# Altium schematic sheet Cymometer.SchDoc
size A3; PageSetup: Record=PageOptions|CenterHorizontal=True|CenterVertical=True|PrintScale=0.73|XCorrection=1.00|YCorrection=1.00|PrintKind=0|BorderSize=5000000|LeftOffset=0|BottomOffset=0|Orientation=2|PaperLength=1000|PaperWidth=1000|Scale=100|PaperSource=7|PrintQuality=-3|MediaType=1|DitherType=10|PrintScaleMode=1|PaperKind=A4|PaperIndex=9
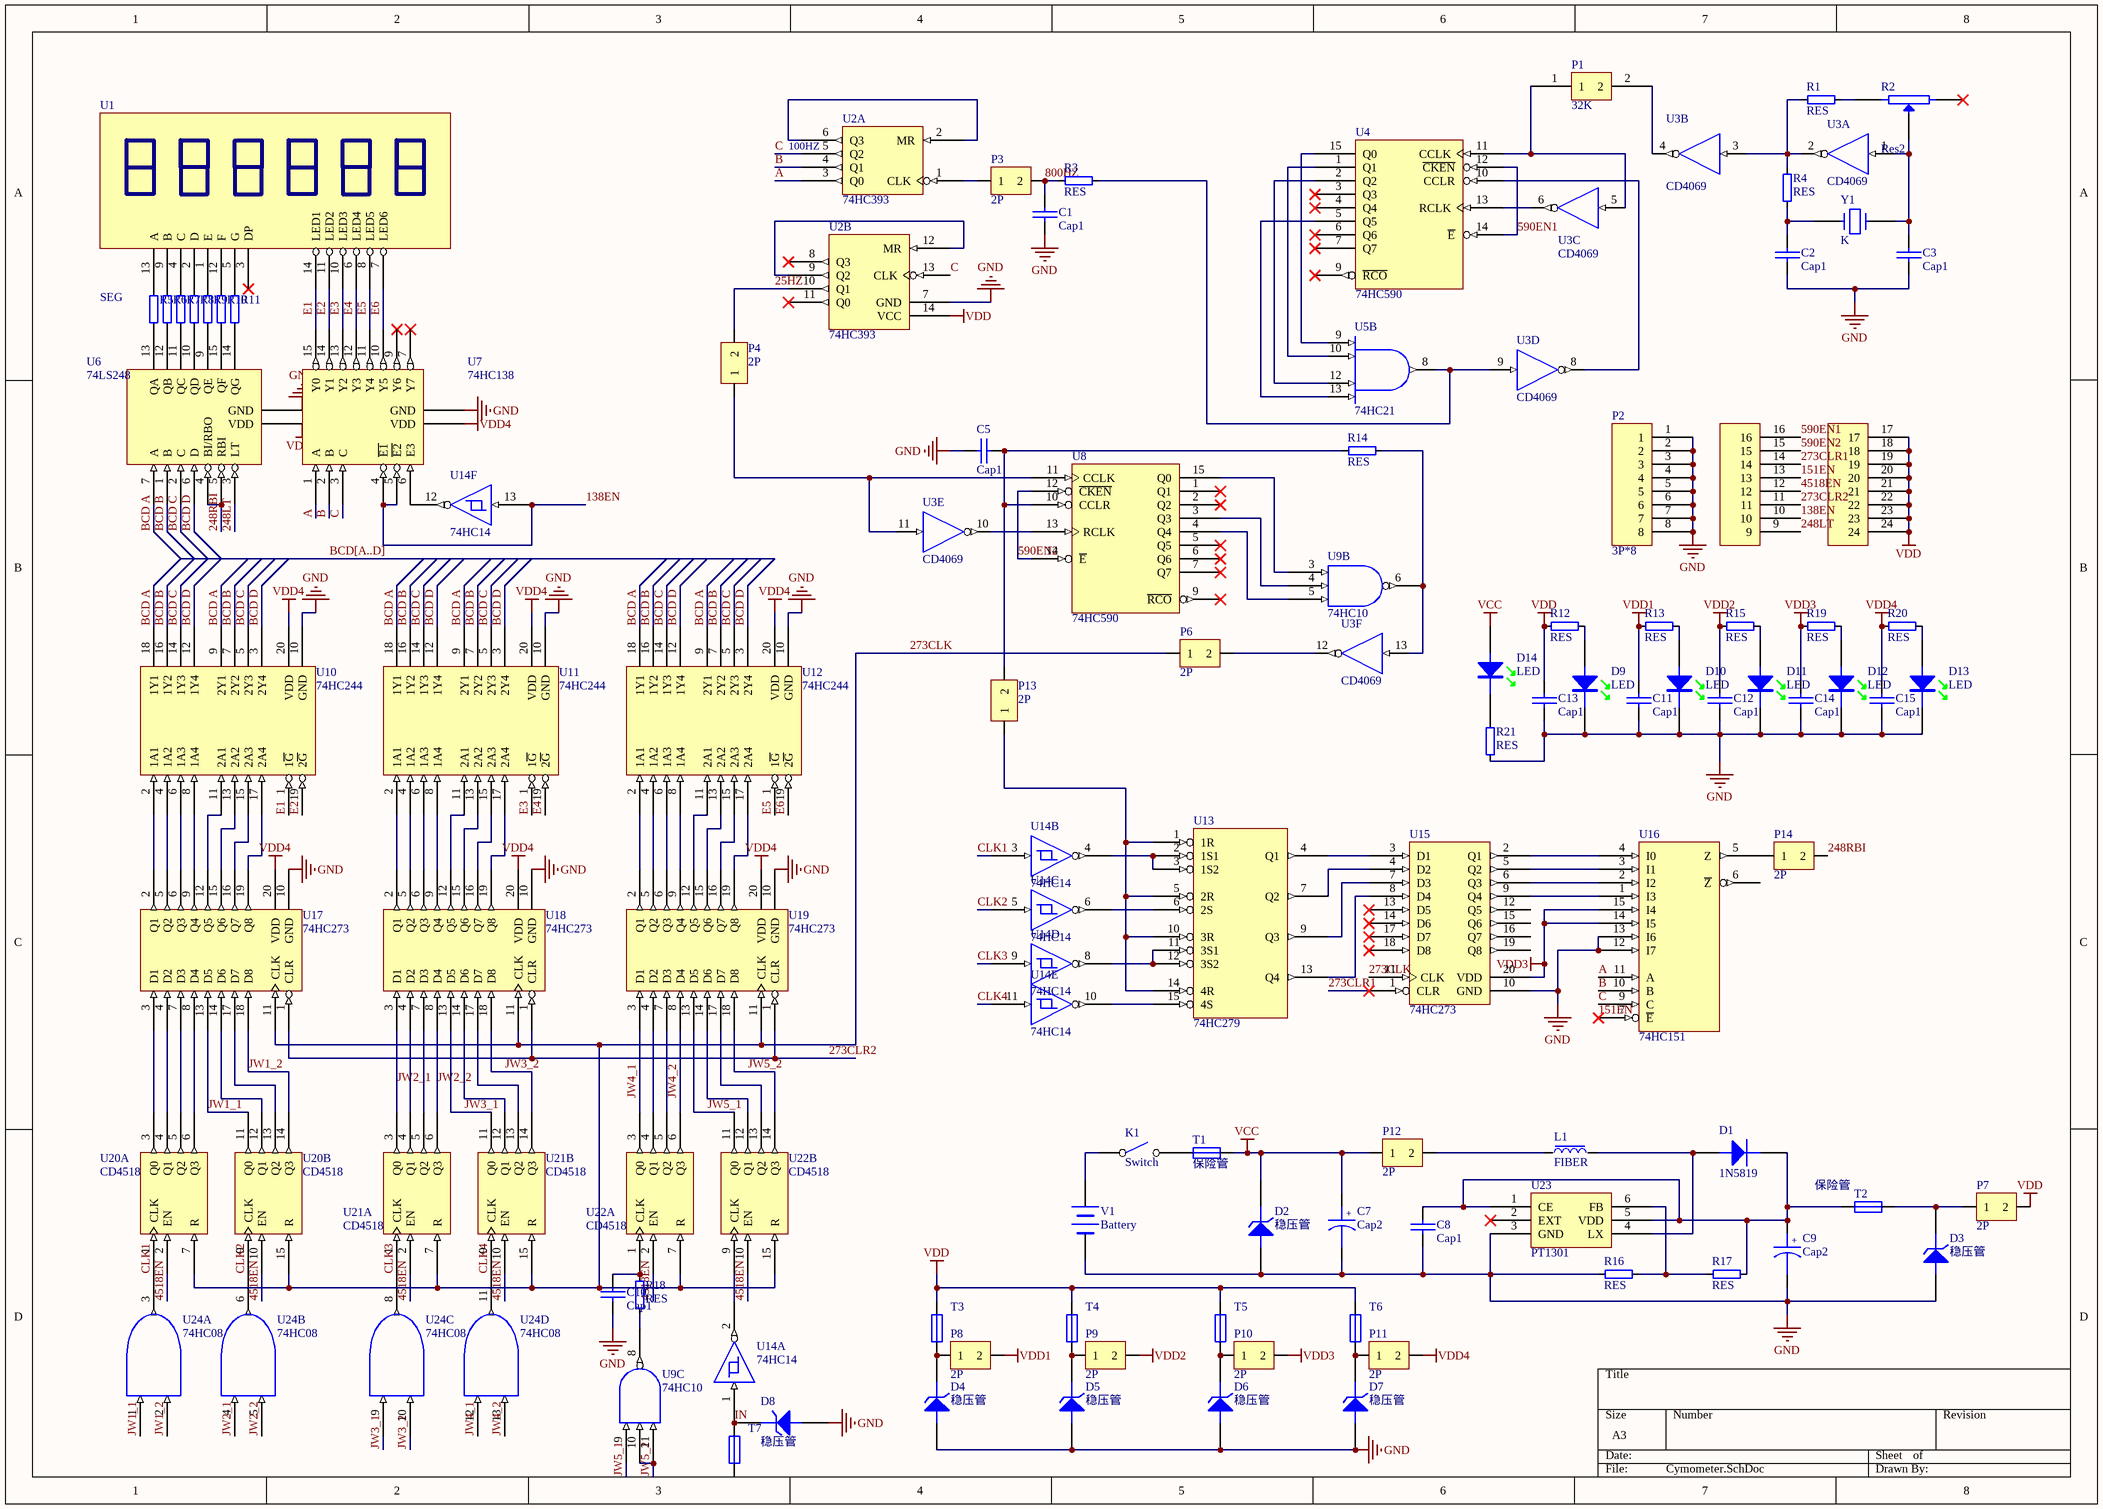
[diagram p0: Cymometer.SchDoc]

## Parts
C1  Cap1  [Cap1]
C2  Cap1  [Cap1]
C3  Cap1  [Cap1]
C5  Cap1  [Cap1]
C7  Cap2  [Cap2]
C8  Cap1  [Cap1]
C9  Cap2  [Cap2]
C10  Cap1  [Cap1]
C11  Cap1  [Cap1]
C12  Cap1  [Cap1]
C13  Cap1  [Cap1]
C14  Cap1  [Cap1]
C15  Cap1  [Cap1]
D1  1N5819  [1N5819(SMA)]
D2  稳压管  [1206稳压管]
D3  稳压管  [1206稳压管]
D4  稳压管  [1206稳压管]
D5  稳压管  [1206稳压管]
D6  稳压管  [1206稳压管]
D7  稳压管  [1206稳压管]
D8  稳压管  [1206稳压管]
D9  LED  [0805LED]
D10  LED  [0805LED]
D11  LED  [0805LED]
D12  LED  [0805LED]
D13  LED  [0805LED]
D14  LED  [0805LED]
K1  Switch  [Switch]
L1  FIBER  [FIBER]
P1  32K  [2P]
P2  3P*8  [3P*8]
P3  2P  [2P]
P4  2P  [2P]
P6  2P  [2P]
P7  2P  [2P]
P8  2P  [2P]
P9  2P  [2P]
P10  2P  [2P]
P11  2P  [2P]
P12  2P  [2P]
P13  2P  [2P]
P14  2P  [2P]
R1  RES  [0805R]
R2  Res2  [Res2]
R3  RES  [0805R]
R4  RES  [0805R]
R5  (no value)  [0805R]
R6  (no value)  [0805R]
R7  (no value)  [0805R]
R8  (no value)  [0805R]
R9  (no value)  [0805R]
R10  (no value)  [0805R]
R11  (no value)  [0805R]
R12  RES  [0805R]
R13  RES  [0805R]
R14  RES  [0805R]
R15  RES  [0805R]
R16  RES  [0805R]
R17  RES  [0805R]
R18  RES  [0805R]
R19  RES  [0805R]
R20  RES  [0805R]
R21  RES  [0805R]
T1  保险管  [0805T]
T2  保险管  [0805T]
T3  保险管  [0805T]  (value not drawn)
T4  保险管  [0805T]  (value not drawn)
T5  保险管  [0805T]  (value not drawn)
T6  保险管  [0805T]  (value not drawn)
T7  保险管  [0805T]  (value not drawn)
U1  SEG  [6BIT_SEG]
U2  74HC393  [SOP14]  (parts A,B of 2)
U3  CD4069  [DIP14]  (parts A,B,C,D,E,F of 6)
U4  74HC590  [SOP16]
U5  74HC21  [SOP14]  (part B of 2)
U6  74LS248  [DIP16]
U7  74HC138  [SOP16]
U8  74HC590  [SOP16]
U9  74HC10  [SOP14]  (parts B,C of 3)
U10  74HC244  [SOP20]
U11  74HC244  [SOP20]
U12  74HC244  [SOP20]
U13  74HC279  [DIP16]
U14  74HC14  [SOP14]  (parts A,B,C,D,E,F of 6)
U15  74HC273  [SOP20]
U16  74HC151  [DIP16]
U17  74HC273  [SOP20]
U18  74HC273  [SOP20]
U19  74HC273  [SOP20]
U20  CD4518  [DIP16]  (parts A,B of 2)
U21  CD4518  [DIP16]  (parts A,B of 2)
U22  CD4518  [DIP16]  (parts A,B of 2)
U23  PT1301  [Sop26]
U24  74HC08  [SOP14]  (parts A,B,C,D of 4)
V1  Battery  [Battry]
Y1  K  [CRYSTAL]

## Nets
GND: C1.1 C2.1 C3.1 C5.2 C7.K C8.1 C9.K C10.1 C11.1 C12.1 C13.1 C14.1 C15.1 D2.A D3.A D4.A D5.A D6.A D7.A D8.A D9.K D10.K D11.K D12.K D13.K P2.1 P2.2 P2.3 P2.4 P2.5 P2.6 P2.7 P2.8 R16.1 R21.2 U2.7(GND) U6.8(GND) U7.8(GND) U10.10(GND) U11.10(GND) U12.10(GND) U15.10(GND) U16.12(I7) U16.13(I6) U17.10(GND) U18.10(GND) U19.10(GND) U23.3(GND) V1.2(-)
VCC: C7.A D2.K D14.A P12.1 T1.2
VDD: C13.2 P2.17 P2.18 P2.19 P2.20 P2.21 P2.22 P2.23 P2.24 P7.2 R12.2 T3.1 T4.2 T5.1 T6.2 U2.14(VCC)
VDD1: C11.2 P8.2 R13.2
VDD2: C12.2 P9.2 R15.2
VDD3: C14.2 P10.2 R19.2 U15.20(VDD) U16.14(I5) U16.15(I4)
VDD4: C15.2 P11.2 R20.2 U6.16(VDD) U7.16(VDD) U10.20(VDD) U11.20(VDD) U12.20(VDD) U17.20(VDD) U18.20(VDD) U19.20(VDD)
25HZ: P4.2 U2.10(Q1)
138EN: P2.10 U7.4(~{E1}) U7.5(~{E2}) U14.13
151EN: P2.13 U16.7(~{E})
248LT: P2.9 U6.3(LT)
248RBI: P14.2 U6.4(BI/RBO) U6.5(RBI)
273CLK: P6.1 U15.11(CLK) U17.11(CLK) U18.11(CLK) U19.11(CLK) U20.7(R) U20.15(R) U21.7(R) U21.15(R) U22.7(R) U22.15(R)
273CLR1: P2.14 U15.1(CLR)
273CLR2: P2.11 U17.1(CLR) U18.1(CLR) U19.1(CLR)
590EN1: P2.16 U4.12(~{CKEN}) U4.14(~{E})
590EN2: P2.15 U8.12(~{CKEN}) U8.14(~{E})
800HZ: C1.2 P3.2 R3.1
4518EN: P2.12 U20.2(EN) U20.10(EN) U21.2(EN) U21.10(EN) U22.2(EN) U22.10(EN)
A: U2.3(Q0) U7.1(A) U16.11(A)
B: U2.4(Q1) U7.2(B) U16.10(B)
BCD A: U6.7(A) U10.9(2Y1) U10.18(1Y1) U11.9(2Y1) U11.18(1Y1) U12.9(2Y1) U12.18(1Y1)
BCD B: U6.1(B) U10.7(2Y2) U10.16(1Y2) U11.7(2Y2) U11.16(1Y2) U12.7(2Y2) U12.16(1Y2)
BCD C: U6.2(C) U10.5(2Y3) U10.14(1Y3) U11.5(2Y3) U11.14(1Y3) U12.5(2Y3) U12.14(1Y3)
BCD D: U6.6(D) U10.3(2Y4) U10.12(1Y4) U11.3(2Y4) U11.12(1Y4) U12.3(2Y4) U12.12(1Y4)
C: U2.5(Q2) U2.13(CLK) U7.3(C) U16.9(C)
CLK1: U14.3 U20.1(CLK) U24.3
CLK2: U14.5 U20.9(CLK) U24.6
CLK3: U14.9 U21.1(CLK) U24.8
CLK4: U14.11 U21.9(CLK) U24.11
E1: U1.14(LED1) U7.15(Y0) U10.1(1~{G})
E2: U1.11(LED2) U7.14(Y1) U10.19(2~{G})
E3: U1.10(LED3) U7.13(Y2) U11.1(1~{G})
E4: U1.6(LED4) U7.12(Y3) U11.19(2~{G})
E5: U1.8(LED5) U7.11(Y4) U12.1(1~{G})
E6: U1.7(LED6) U7.10(Y5) U12.19(2~{G})
IN: D8.K T7.1 U14.1
JW1_1: U17.13(D5) U20.11(Q0) U24.1
JW1_2: U17.18(D8) U20.14(Q3) U24.2
JW2_1: U18.3(D1) U21.3(Q0) U24.4
JW2_2: U18.8(D4) U21.6(Q3) U24.5
JW3_1: U18.13(D5) U21.11(Q0) U24.9
JW3_2: U18.18(D8) U21.14(Q3) U24.10
JW4_1: U19.3(D1) U22.3(Q0) U24.12
JW4_2: U19.8(D4) U22.6(Q3) U24.13
JW5_1: U9.9 U19.13(D5) U22.11(Q0)
JW5_2: U9.10 U9.11 U19.18(D8) U22.14(Q3)
NetC2_2: C2.2 R4.1 Y1.1
NetC3_2: C3.2 R2.3(W) U3.1(A) Y1.2
NetC5_1: C5.1 P13.2 R14.1 U8.10(CCLR)
NetC8_2: C8.2 C9.A D1.K R17.2 T2.1 U23.1(CE) U23.5(VDD)
NetC10_2: C10.2 R18.2 U22.1(CLK)
NetD1_A: D1.A L1.2 U23.4(LX)
NetD3_K: D3.K P7.1 T2.2
NetD4_K: D4.K P8.1 T3.2
NetD5_K: D5.K P9.1 T4.1
NetD6_K: D6.K P10.1 T5.2
NetD7_K: D7.K P11.1 T6.1
NetD9_A: D9.A R12.1
NetD10_A: D10.A R13.1
NetD11_A: D11.A R15.1
NetD12_A: D12.A R19.1
NetD13_A: D13.A R20.1
NetD14_K: D14.K R21.1
NetK1_1: K1.1 V1.1(+)
NetK1_2: K1.2 T1.1
NetL1_1: L1.1 P12.2
NetP1_1: P1.1 U3.5(A) U4.11(CCLK)
NetP1_2: P1.2 U3.4(Y)
NetP3_1: P3.1 U2.1(CLK)
NetP4_1: P4.1 U3.11(A) U8.11(CCLK)
NetP6_2: P6.2 U3.12(Y)
NetP13_1: P13.1 U13.1(1R) U13.5(2R) U13.10(3R) U13.14(4R)
NetP14_1: P14.1 U16.5(Z)
NetR1_1: R1.1 R2.2
NetR1_2: R1.2 R4.2 U3.2(Y) U3.3(A)
NetR3_2: R3.2 U3.9(A) U5.8(Y)
NetR5_1: R5.1 U6.13(QA)
NetR5_2: R5.2 U1.13(A)
NetR6_1: R6.1 U6.12(QB)
NetR6_2: R6.2 U1.9(B)
NetR7_1: R7.1 U6.11(QC)
NetR7_2: R7.2 U1.4(C)
NetR8_1: R8.1 U6.10(QD)
NetR8_2: R8.2 U1.2(D)
NetR9_1: R9.1 U6.9(QE)
NetR9_2: R9.2 U1.1(E)
NetR10_1: R10.1 U6.15(QF)
NetR10_2: R10.2 U1.12(F)
NetR11_1: R11.1 U6.14(QG)
NetR11_2: R11.2 U1.5(G)
NetR14_2: R14.2 U3.13(A) U9.6
NetR16_2: R16.2 R17.1 U23.6(FB)
NetR18_1: R18.1 U9.8
NetU2_2: U2.2(MR) U2.6(Q3)
NetU2_9: U2.9(Q2) U2.12(MR)
NetU3_6: U3.6(Y) U4.13(RCLK)
NetU3_8: U3.8(Y) U4.10(CCLR)
NetU3_10: U3.10(Y) U8.13(RCLK)
NetU4_1: U4.1(Q1) U5.10(B)
NetU4_2: U4.2(Q2) U5.12(C)
NetU4_5: U4.5(Q5) U5.13(D)
NetU4_15: U4.15(Q0) U5.9(A)
NetU7_6: U7.6(E3) U14.12
NetU8_3: U8.3(Q3) U9.4
NetU8_4: U8.4(Q4) U9.5
NetU8_15: U8.15(Q0) U9.3
NetU10_2: U10.2(1A1) U17.2(Q1)
NetU10_4: U10.4(1A2) U17.5(Q2)
NetU10_6: U10.6(1A3) U17.6(Q3)
NetU10_8: U10.8(1A4) U17.9(Q4)
NetU10_11: U10.11(2A1) U17.12(Q5)
NetU10_13: U10.13(2A2) U17.15(Q6)
NetU10_15: U10.15(2A3) U17.16(Q7)
NetU10_17: U10.17(2A4) U17.19(Q8)
NetU11_2: U11.2(1A1) U18.2(Q1)
NetU11_4: U11.4(1A2) U18.5(Q2)
NetU11_6: U11.6(1A3) U18.6(Q3)
NetU11_8: U11.8(1A4) U18.9(Q4)
NetU11_11: U11.11(2A1) U18.12(Q5)
NetU11_13: U11.13(2A2) U18.15(Q6)
NetU11_15: U11.15(2A3) U18.16(Q7)
NetU11_17: U11.17(2A4) U18.19(Q8)
NetU12_2: U12.2(1A1) U19.2(Q1)
NetU12_4: U12.4(1A2) U19.5(Q2)
NetU12_6: U12.6(1A3) U19.6(Q3)
NetU12_8: U12.8(1A4) U19.9(Q4)
NetU12_11: U12.11(2A1) U19.12(Q5)
NetU12_13: U12.13(2A2) U19.15(Q6)
NetU12_15: U12.15(2A3) U19.16(Q7)
NetU12_17: U12.17(2A4) U19.19(Q8)
NetU13_2: U13.2(1S1) U13.3(1S2) U14.4
NetU13_4: U13.4(Q1) U15.3(D1)
NetU13_6: U13.6(2S) U14.6
NetU13_7: U13.7(Q2) U15.4(D2)
NetU13_9: U13.9(Q3) U15.7(D3)
NetU13_11: U13.11(3S1) U13.12(3S2) U14.8
NetU13_13: U13.13(Q4) U15.8(D4)
NetU13_15: U13.15(4S) U14.10
NetU14_2: U14.2 U22.9(CLK)
NetU15_2: U15.2(Q1) U16.4(I0)
NetU15_5: U15.5(Q2) U16.3(I1)
NetU15_6: U15.6(Q3) U16.2(I2)
NetU15_9: U15.9(Q4) U16.1(I3)
NetU17_3: U17.3(D1) U20.3(Q0)
NetU17_4: U17.4(D2) U20.4(Q1)
NetU17_7: U17.7(D3) U20.5(Q2)
NetU17_8: U17.8(D4) U20.6(Q3)
NetU17_14: U17.14(D6) U20.12(Q1)
NetU17_17: U17.17(D7) U20.13(Q2)
NetU18_4: U18.4(D2) U21.4(Q1)
NetU18_7: U18.7(D3) U21.5(Q2)
NetU18_14: U18.14(D6) U21.12(Q1)
NetU18_17: U18.17(D7) U21.13(Q2)
NetU19_4: U19.4(D2) U22.4(Q1)
NetU19_7: U19.7(D3) U22.5(Q2)
NetU19_14: U19.14(D6) U22.12(Q1)
NetU19_17: U19.17(D7) U22.13(Q2)

Not connected (* = marked no-connect by the designer): R2 1*; T7 2; U1 3(DP)*; U2 8(Q3)* 11(Q0)*; U4 3(Q3)* 4(Q4)* 6(Q6)* 7(Q7)* 9(~{RCO})*; U7 7(Y7)* 9(Y6)*; U8 1(Q1)* 2(Q2)* 5(Q5)* 6(Q6)* 7(Q7)* 9(~{RCO})*; U15 12(Q5) 13(D5)* 14(D6)* 15(Q6) 16(Q7) 17(D7)* 18(D8)* 19(Q8); U16 6(~{Z}); U23 2(EXT)*

## Buses and harness runs
bus BCD[A..D]

## Notes on the sheet
- (near U2) 100HZ
- (in symbol Cap2) +

## Library data of the parts
P1 = 2P
R1 R3-R21 = RES: 电阻
U1 = SEG: 数码管
U3 = CD4069: CMOS非门
U5 = 74HC21: 4输入与门
U6 = 74LS248: 数码管译码器
U7 = 74HC138: 38译码器
U10-U12 = 74HC244: 三态缓冲器
U15 U17-U19 = 74HC273: D触发器
U20-U22 = CD4518: BCD计数器
U24 = 74HC08: 二输入与门
Y1 = CRYSTAL: 晶振